# EAGLE design ma8x8_interface (EAGLE 6.6.0)
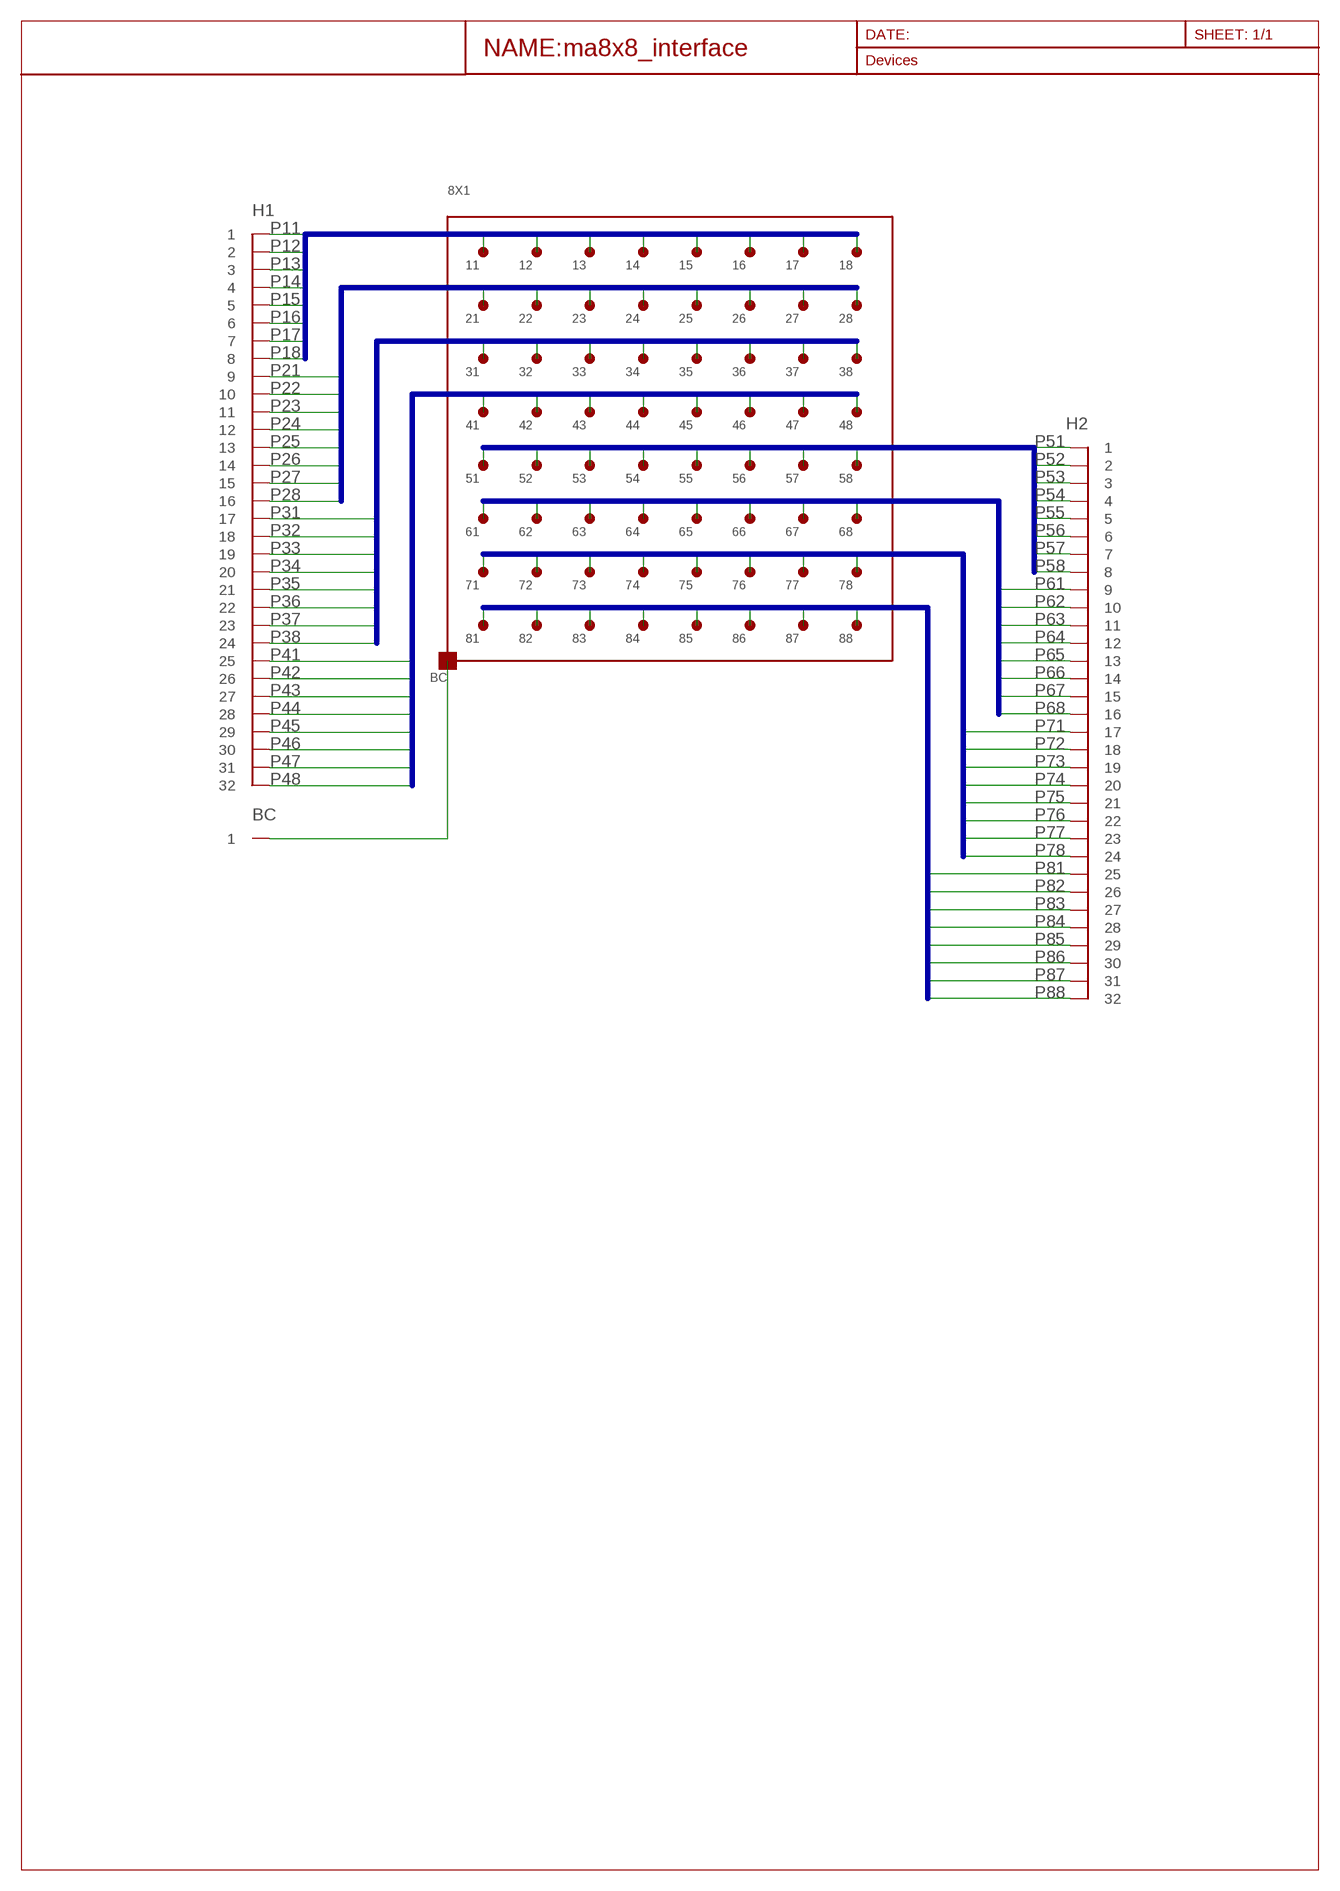
[diagram p0: schematic, sheet 1]

## Parts
8X1  8X8-POGO  [8X8-POGO]
BC  D01-9920146  [D01-9920146]
H1  D01-9923246  [D01-9923246]
H2  D01-9923246  [D01-9923246]

## Nets
BC: 8X1.B1(B) 8X1.B2(B) 8X1.B3(B) 8X1.B4(B) 8X1.B5(B) 8X1.B6(B) 8X1.B7(B) 8X1.B8(B) BC.1
P11: 8X1.11 H1.1
P12: 8X1.12 H1.2
P13: 8X1.13 H1.3
P14: 8X1.14 H1.4
P15: 8X1.15 H1.5
P16: 8X1.16 H1.6
P17: 8X1.17 H1.7
P18: 8X1.18 H1.8
P21: 8X1.21 H1.9
P22: 8X1.22 H1.10
P23: 8X1.23 H1.11
P24: 8X1.24 H1.12
P25: 8X1.25 H1.13
P26: 8X1.26 H1.14
P27: 8X1.27 H1.15
P28: 8X1.28 H1.16
P31: 8X1.31 H1.17
P32: 8X1.32 H1.18
P33: 8X1.33 H1.19
P34: 8X1.34 H1.20
P35: 8X1.35 H1.21
P36: 8X1.36 H1.22
P37: 8X1.37 H1.23
P38: 8X1.38 H1.24
P41: 8X1.41 H1.25
P42: 8X1.42 H1.26
P43: 8X1.43 H1.27
P44: 8X1.44 H1.28
P45: 8X1.45 H1.29
P46: 8X1.46 H1.30
P47: 8X1.47 H1.31
P48: 8X1.48 H1.32
P51: 8X1.51 H2.1
P52: 8X1.52 H2.2
P53: 8X1.53 H2.3
P54: 8X1.54 H2.4
P55: 8X1.55 H2.5
P56: 8X1.56 H2.6
P57: 8X1.57 H2.7
P58: 8X1.58 H2.8
P61: 8X1.61 H2.9
P62: 8X1.62 H2.10
P63: 8X1.63 H2.11
P64: 8X1.64 H2.12
P65: 8X1.65 H2.13
P66: 8X1.66 H2.14
P67: 8X1.67 H2.15
P68: 8X1.68 H2.16
P71: 8X1.71 H2.17
P72: 8X1.72 H2.18
P73: 8X1.73 H2.19
P74: 8X1.74 H2.20
P75: 8X1.75 H2.21
P76: 8X1.76 H2.22
P77: 8X1.77 H2.23
P78: 8X1.78 H2.24
P81: 8X1.81 H2.25
P82: 8X1.82 H2.26
P83: 8X1.83 H2.27
P84: 8X1.84 H2.28
P85: 8X1.85 H2.29
P86: 8X1.86 H2.30
P87: 8X1.87 H2.31
P88: 8X1.88 H2.32

## Buses
P[11..18]
P[21..28]
P[31..38]
P[41..48]
P[51..58]
P[61..68]
P[71..78]
P[81..88]

## Library data of the parts
8X1 = pv-measurement-array:8X8-POGO
BC = con-headers-harvin:D01-9920146
H1 H2 = con-headers-harvin:D01-9923246

## Board
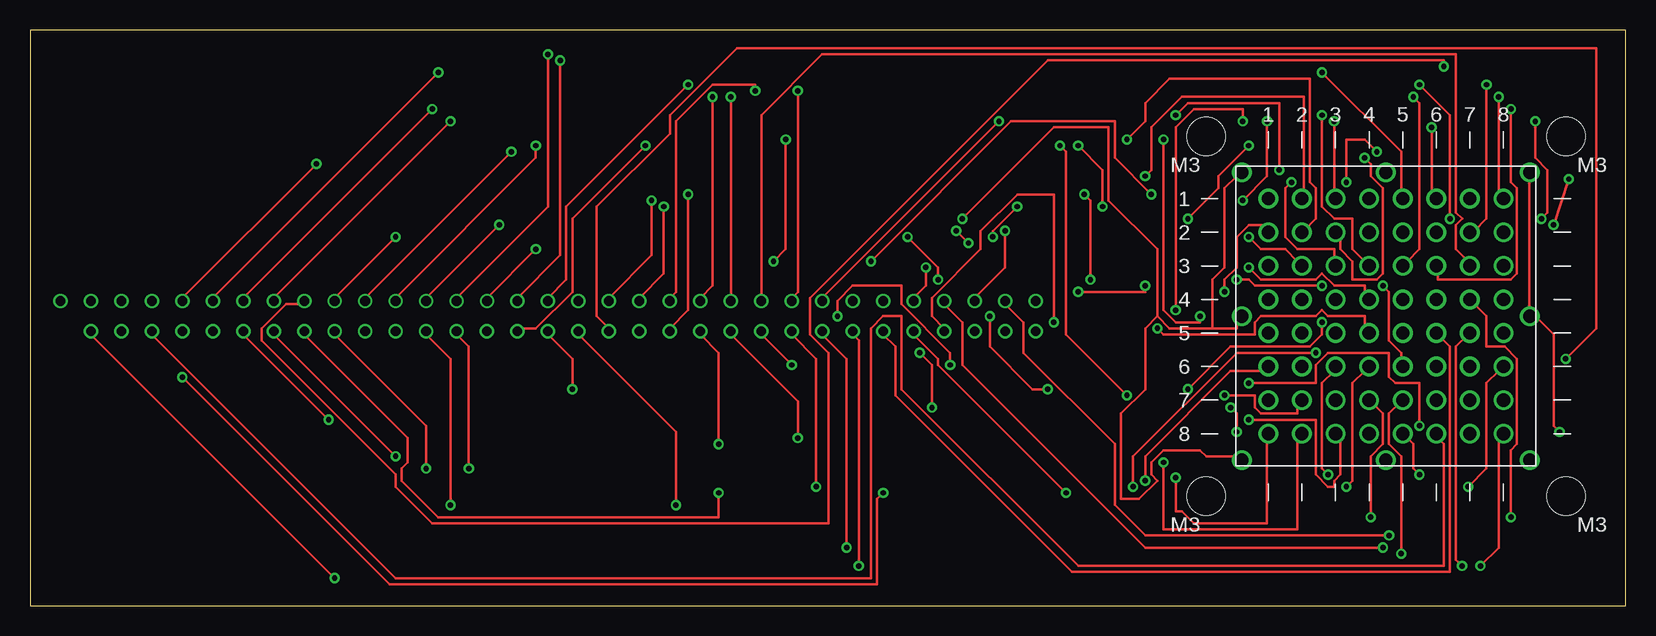
[diagram p1: board, top side]
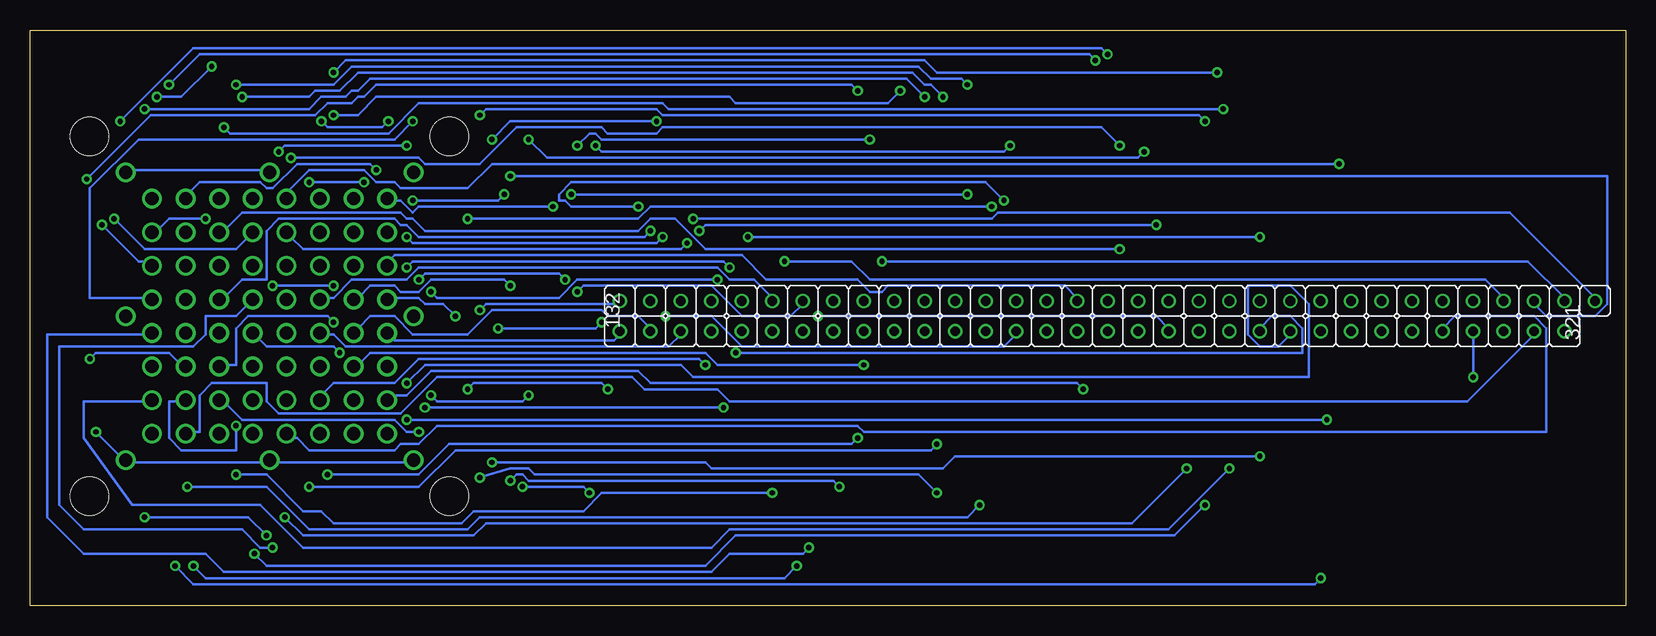
[diagram p2: board, bottom side, seen from below]

Size 133 x 48 mm. Coordinates in mm from the lower left corner, seen from the top.
Outline: 0,0 133,0 133,48 0,48 0,0
Copper layers (1*16): Top 0.035mm / dielectric 1.5mm / Bottom 0.035mm
Design rules "aisler_2_layer_simple": minimum track width 0.2mm, minimum drill 0.45mm, track to track 0.175mm, track to pad 0.175mm, pad to pad 0.175mm, via to via 0.175mm, smd to smd 0.175mm, copper to edge 0.3mm, drill to drill 0.25mm, minimum pad ring 0.2mm, minimum via ring 0.2mm, stop-mask expansion 0mil, vias tented up to drill 0mil, thermal gap 10mil
tRestrict: area 96,37.1 to 100.1,41.1; area 126,37.1 to 130,41.1; area 126,7.1 to 130,11.2; area 96,7.1 to 100.1,11.2
bRestrict: area 96,37.1 to 100.1,41.1; area 126,37.1 to 130,41.1; area 126,7.1 to 130,11.2; area 96,7.1 to 100.1,11.2

### Footprints (pad centres in the part's own frame; a part is rotated, then mirrored left to right if it is on the bottom)
8X8-POGO = drill 1.1: 11 -9.8,9.8; 12 -7,9.8; 13 -4.2,9.8; 14 -1.4,9.8; 15 1.4,9.8; 16 4.2,9.8; 17 7,9.8; 18 9.8,9.8; 21 -9.8,7; 22 -7,7; 23 -4.2,7; 24 -1.4,7; 25 1.4,7; 26 4.2,7; 27 7,7; 28 9.8,7; 31 -9.8,4.2; 32 -7,4.2; 33 -4.2,4.2; 34 -1.4,4.2; 35 1.4,4.2; 36 4.2,4.2; 37 7,4.2; 38 9.8,4.2; 41 -9.8,1.4; 42 -7,1.4; 43 -4.2,1.4; 44 -1.4,1.4; 45 1.4,1.4; 46 4.2,1.4; 47 7,1.4; 48 9.8,1.4; 51 -9.8,-1.4; 52 -7,-1.4; 53 -4.2,-1.4; 54 -1.4,-1.4; 55 1.4,-1.4; 56 4.2,-1.4; 57 7,-1.4; 58 9.8,-1.4; 61 -9.8,-4.2; 62 -7,-4.2; 63 -4.2,-4.2; 64 -1.4,-4.2; 65 1.4,-4.2; 66 4.2,-4.2; 67 7,-4.2; 68 9.8,-4.2; 71 -9.8,-7; 72 -7,-7; 73 -4.2,-7; 74 -1.4,-7; 75 1.4,-7; 76 4.2,-7; 77 7,-7; 78 9.8,-7; 81 -9.8,-9.8; 82 -7,-9.8; 83 -4.2,-9.8; 84 -1.4,-9.8; 85 1.4,-9.8; 86 4.2,-9.8; 87 7,-9.8; 88 9.8,-9.8; B1 -12,12; B2 0,12; B3 12,12; B4 12,0; B5 12,-12; B6 0,-12; B7 -12,-12; B8 -12,0 | hole 3.2: -15,15; 15,15; 15,-15; -15,-15
D01-9920146 = drill 0.8: 1 0,0
D01-9923246 = drill 0.8: 1 0,0; 2 0,2.54; 3 0,5.08; 4 0,7.62; 5 0,10.16; 6 0,12.7; 7 0,15.24; 8 0,17.78; 9 0,20.32; 10 0,22.86; 11 0,25.4; 12 0,27.94; 13 0,30.48; 14 0,33.02; 15 0,35.56; 16 0,38.1; 17 0,40.64; 18 0,43.18; 19 0,45.72; 20 0,48.26; 21 0,50.8; 22 0,53.34; 23 0,55.88; 24 0,58.42; 25 0,60.96; 26 0,63.5; 27 0,66.04; 28 0,68.58; 29 0,71.12; 30 0,73.66; 31 0,76.2; 32 0,78.74

### Placement (x,y rotation side)
8X1  113.03,24.13 0 top
BC  2.54,25.4 0 bottom
H1  5.08,25.4 90 bottom
H2  83.82,22.86 270 bottom

### Tracks (layer width: path | path; a pad name or v marks a point on that pad's centre or on a via)
BC  (via drill 0.45)
  Top 0.2: 8X1.B3 124.97,35.81 124.97,24.13 8X1.B4 125.48,24.13 127,22.61 127,14.99 v127.51,14.48 | v77.72,32.26 85.34,39.88 89.92,39.88 89.92,33.78 93.98,29.72 93.98,24.13 | 93.98,24.13 95,23.11 98.55,23.11 | 98.55,23.11 100.58,23.11 100.58,24.13 8X1.B8 | 98.55,23.11 98.55,27.18 99.57,28.19 99.57,34.8 100.58,35.81 8X1.B1 | 93.98,24.13 92.96,23.11 92.96,18.03 90.93,16 90.93,8.89 92.46,8.89 93.98,10.41 93.47,10.92 93.47,11.94 94.49,12.95 97.54,12.95 98.04,12.45 100.58,12.45 8X1.B7
  Bottom 0.2: 8X1.B7 101.09,11.94 112.78,11.94 8X1.B6 113.28,11.94 124.97,11.94 8X1.B5 125.48,12.45 v127.51,14.48 | 8X1.B2 113.28,36.32 124.97,36.32 8X1.B3 | v77.72,32.26 52.83,32.26 52.32,32.77 9.65,32.77 2.54,25.65 BC.1
P11  (via drill 0.45)
  Top 0.2: v61.98,28.7 62.99,29.72 v62.99,38.86 | v87.38,38.35 89.41,36.32 v89.41,33.27
  Bottom 0.2: v61.98,28.7 8.13,28.7 5.08,25.65 H1.1 | v62.99,38.86 85.34,38.86 85.85,39.37 86.36,39.37 v87.38,38.35 | v89.41,33.27 100.58,33.27 101.09,32.77 102.11,33.78 103.12,33.78 8X1.11
P12  (via drill 0.45)
  Top 0.2: v92.96,35.81 93.47,36.32 93.47,39.88 96.01,42.42 106.17,42.42 106.17,34.29 8X1.12
  Bottom 0.2: v92.96,35.81 1.52,35.81 1.52,25.15 2.54,24.13 6.6,24.13 7.62,25.15 H1.2
P13  (via drill 0.45)
  Top 0.2: v70.1,28.7 81.79,40.39 90.42,40.39 90.42,37.34 v93.47,34.29 | v101.09,33.78 103.12,35.81 v103.12,40.39 | v108.71,40.39 108.71,34.29 8X1.13
  Bottom 0.2: v70.1,28.7 64.52,28.7 62.99,27.18 11.68,27.18 10.16,25.65 H1.3 | v93.47,34.29 93.98,33.78 v101.09,33.78 | v103.12,40.39 103.63,39.88 108.2,39.88 v108.71,40.39
P14  (via drill 0.45)
  Top 0.2: v23.88,36.83 12.7,25.65 H1.4
  Bottom 0.2: v23.88,36.83 94.49,36.83 96.52,34.8 102.11,34.8 102.62,35.31 104.14,35.31 105.16,36.32 109.73,36.32 111.76,34.29 8X1.14
P15  (via drill 0.45)
  Top 0.2: v34.04,44.45 15.24,25.65 H1.5 | v107.7,44.45 114.3,37.85 114.3,34.29 8X1.15
  Bottom 0.2: v34.04,44.45 57.4,44.45 58.42,45.47 106.68,45.47 v107.7,44.45
P16  (via drill 0.45)
  Top 0.2: v33.53,41.4 17.78,25.65 H1.6 | v116.84,39.88 116.84,34.29 8X1.16
  Bottom 0.2: v33.53,41.4 79.76,41.4 80.26,41.91 100.58,41.91 103.12,39.37 116.33,39.37 v116.84,39.88
P17  (via drill 0.45)
  Top 0.2: v35.05,40.39 20.32,25.65 H1.7 | v95.5,40.89 96.52,41.91 104.14,41.91 v104.14,36.32
  Bottom 0.2: v35.05,40.39 35.56,40.89 80.26,40.89 80.77,41.4 95,41.4 v95.5,40.89 | v104.14,36.32 104.65,36.83 110.74,36.83 112.78,34.8 113.28,34.8 113.79,35.31 118.87,35.31 119.89,34.29 8X1.17
P18  (via drill 0.45)
  Top 0.2: v117.86,44.96 117.86,45.47 84.84,45.47 65.02,25.65 65.02,22.61 66.55,21.08 66.55,6.86 33.53,6.86 30.48,9.91 30.48,10.92 19.3,22.1 19.3,23.11 21.34,25.15 22.86,25.15 H1.8 | v122.43,42.42 122.43,34.29 8X1.18
  Bottom 0.2: v117.86,44.96 120.4,42.42 v122.43,42.42
P21  (via drill 0.45)
  Top 0.2: v30.48,30.73 25.4,25.65 H1.9 | v73.15,30.73 75.69,28.19 v75.69,27.18 | v99.57,26.16 99.57,27.18 100.58,28.19 100.58,30.73 101.6,31.75 103.12,31.75 103.12,31.24 8X1.21
  Bottom 0.2: v73.15,30.73 v30.48,30.73 | v75.69,27.18 87.38,27.18 88.9,25.65 99.06,25.65 v99.57,26.16
P22  (via drill 0.45)
  Top 0.2: v40.13,37.85 27.94,25.65 H1.10 | v91.44,38.86 92.96,40.39 92.96,41.91 95,43.94 106.68,43.94 106.68,35.31 107.19,34.8 107.19,32.26 106.17,31.24 8X1.22
  Bottom 0.2: v40.13,37.85 40.64,37.34 89.92,37.34 v91.44,38.86
P23  (via drill 0.45)
  Top 0.2: v42.16,38.35 42.16,37.34 30.48,25.65 H1.11 | v111.25,37.34 111.76,36.83 111.76,35.81 112.78,34.8 112.78,27.69 112.27,27.18 110.24,27.18 110.24,28.7 109.22,29.72 109.22,30.73 8X1.23
  Bottom 0.2: v42.16,38.35 43.69,39.88 80.26,39.88 80.77,39.37 84.84,39.37 85.34,39.88 92.46,39.88 95.5,36.83 100.08,36.83 100.58,37.34 v111.25,37.34
P24  (via drill 0.45)
  Top 0.2: v39.12,31.75 33.02,25.65 H1.12 | v78.23,30.23 v77.22,31.24
  Bottom 0.2: v39.12,31.75 76.71,31.75 v77.22,31.24 | v78.23,30.23 78.74,29.72 110.24,29.72 111.25,30.73 8X1.24
P25  (via drill 0.45)
  Top 0.2: v43.18,45.97 43.18,33.27 35.56,25.65 H1.13 | v125.48,40.39 125.48,37.34 126.49,36.32 126.49,32.77 v125.98,32.26
  Bottom 0.2: v43.18,45.97 43.69,46.48 119.38,46.48 v125.48,40.39 | v125.98,32.26 123.44,29.72 115.82,29.72 114.81,30.73 8X1.25
P26  (via drill 0.45)
  Top 0.2: v42.16,29.72 38.1,25.65 H1.14
  Bottom 0.2: v42.16,29.72 76.71,29.72 79.25,32.26 81.28,32.26 82.3,31.24 100.08,31.24 101.09,32.26 101.6,32.26 102.11,32.77 115.32,32.77 116.84,31.24 8X1.26
P27  (via drill 0.45)
  Top 0.2: v44.2,45.47 44.2,29.21 40.64,25.65 H1.15 | v121.41,43.43 121.41,32.26 120.4,31.24 8X1.27
  Bottom 0.2: v44.2,45.47 44.7,45.97 118.87,45.97 v121.41,43.43
P28  (via drill 0.45)
  Top 0.2: v54.86,43.43 44.7,33.27 44.7,27.18 43.18,25.65 H1.16 | v115.82,43.43 118.36,40.89 v118.36,32.26
  Bottom 0.2: v54.86,43.43 55.37,43.94 57.91,43.94 58.93,44.96 106.17,44.96 107.7,43.43 v115.82,43.43 | v118.36,32.26 121.41,32.26 122.43,31.24 8X1.28
P31
  Bottom 0.2: H1.17 45.72,25.65 46.74,26.67 61.47,26.67 61.98,26.16 62.99,26.16 64.01,27.18 71.63,27.18 73.66,29.21 102.62,29.21 103.12,28.7 8X1.31
P32  (via drill 0.45)
  Top 0.2: v51.82,33.78 51.82,29.21 48.26,25.65 H1.18 | v82.3,33.27 80.26,31.24 v80.26,30.73 | v101.6,30.73 102.62,29.72 104.65,29.72 105.66,28.7 8X1.32
  Bottom 0.2: v51.82,33.78 53.34,35.31 87.88,35.31 88.9,34.29 88.9,33.78 88.39,33.78 87.88,33.27 v82.3,33.27 | v80.26,30.73 80.77,30.23 101.09,30.23 v101.6,30.73
P33  (via drill 0.45)
  Top 0.2: v52.83,33.27 52.83,27.69 50.8,25.65 H1.19 | v96.52,32.26 99.06,34.8 99.06,35.81 v101.6,38.35 | v112.27,37.85 111.25,38.86 109.73,38.86 v109.73,35.31 | v105.16,35.31 104.65,34.8 104.65,30.73 105.66,29.72 108.71,29.72 108.71,28.7 8X1.33
  Bottom 0.2: v52.83,33.27 81.28,33.27 82.3,32.26 v96.52,32.26 | v101.6,38.35 111.76,38.35 v112.27,37.85 | v105.16,35.31 v109.73,35.31
P34  (via drill 0.45)
  Top 0.2: v60.45,42.93 60.45,43.43 56.9,43.43 53.85,40.39 53.85,26.16 53.34,25.65 H1.20 | v107.7,40.89 107.7,33.27 108.71,32.26 110.24,32.26 110.24,29.72 111.25,28.7 8X1.34
  Bottom 0.2: v60.45,42.93 61.47,41.91 74.17,41.91 74.68,42.42 104.14,42.42 105.66,40.89 v107.7,40.89
P35  (via drill 0.45)
  Top 0.2: v56.9,42.42 56.9,26.67 55.88,25.65 H1.21 | v115.32,42.42 115.82,41.91 115.82,29.72 114.81,28.7 8X1.35
  Bottom 0.2: v56.9,42.42 57.91,43.43 58.42,43.43 59.44,44.45 105.66,44.45 107.19,42.93 109.22,42.93 109.73,42.42 v115.32,42.42
P36  (via drill 0.45)
  Top 0.2: v58.42,42.42 H1.22 | v123.44,41.4 123.44,35.31 123.95,34.8 123.95,27.69 123.44,27.18 117.35,27.18 117.35,28.19 8X1.36
  Bottom 0.2: v58.42,42.42 59.94,43.94 104.65,43.94 105.66,42.93 106.17,42.93 106.68,42.42 108.71,42.42 109.73,41.4 v123.44,41.4
P37
  Top 0.2: H1.23 60.96,40.89 66.04,45.97 118.87,45.97 118.87,32.77 119.38,32.26 118.87,31.75 118.87,29.72 119.89,28.7 8X1.37
P38  (via drill 0.45)
  Top 0.2: v64.01,42.93 64.01,26.16 63.5,25.65 H1.24 | v127,31.75 v128.27,35.56
  Bottom 0.2: v64.01,42.93 64.52,43.43 104.14,43.43 105.16,42.42 105.66,42.42 106.17,41.91 108.2,41.91 109.22,40.89 122.94,40.89 v128.27,35.56 | v127,31.75 123.95,28.7 122.94,28.7 8X1.38
P41  (via drill 0.45)
  Top 0.2: v80.77,40.39 66.04,25.65 H1.25 | v94.49,38.86 94.49,24.64 95.5,23.62 97.54,23.62 v97.54,24.13
  Bottom 0.2: v80.77,40.39 92.96,40.39 v94.49,38.86 | v97.54,24.13 98.55,25.15 100.08,25.15 100.58,25.65 103.12,25.65 8X1.41
P42  (via drill 0.45)
  Top 0.2: v87.38,26.16 92.96,26.16 v92.96,26.67
  Bottom 0.2: v87.38,26.16 86.87,26.67 76.2,26.67 73.66,24.13 69.6,24.13 68.58,25.15 H1.26 | v92.96,26.67 93.47,27.18 99.57,27.18 100.58,26.16 102.11,26.16 102.62,26.67 104.65,26.67 105.66,25.65 8X1.42
P43
  Bottom 0.2: H1.27 71.12,25.65 72.64,27.18 74.68,27.18 75.69,28.19 100.58,28.19 101.6,27.18 106.17,27.18 107.7,25.65 108.71,25.65 8X1.43
P44  (via drill 0.45)
  Top 0.2: v74.68,28.19 74.68,26.67 73.66,25.65 H1.28 | v101.6,28.19 102.62,27.18 107.19,27.18 107.7,27.69 108.71,26.67 111.25,26.67 111.25,25.65 8X1.44
  Bottom 0.2: v74.68,28.19 75.18,28.7 101.09,28.7 v101.6,28.19
P45  (via drill 0.45)
  Top 0.2: v112.78,4.83 92.96,4.83 77.72,20.07 77.72,23.62 76.2,25.15 H1.29
  Bottom 0.2: v112.78,4.83 113.79,4.83 115.32,6.35 128.52,6.35 130.56,8.38 130.56,21.59 119.38,21.59 118.36,22.61 118.36,24.13 115.82,24.13 114.81,25.15 8X1.45
P46  (via drill 0.45)
  Top 0.2: v81.28,31.24 81.28,28.19 78.74,25.65 H1.30
  Bottom 0.2: v81.28,31.24 81.79,30.73 100.58,30.73 101.6,31.75 102.11,31.75 102.62,32.26 112.27,32.26 113.28,31.24 113.28,27.18 115.32,27.18 116.84,25.65 8X1.46
P47  (via drill 0.45)
  Top 0.2: v113.28,5.84 92.96,5.84 90.42,8.38 90.42,13.46 82.8,21.08 82.8,23.62 81.28,25.15 H1.31 | v123.44,7.37 123.44,12.95 123.95,13.46 123.95,20.57 122.94,21.59 121.41,21.59 121.41,24.13 120.4,25.15 8X1.47
  Bottom 0.2: v113.28,5.84 114.81,7.37 v123.44,7.37
P48  (via drill 0.45)
  Top 0.2: v95.5,24.64 95.5,39.88 97.03,41.4 101.09,41.4 v101.09,40.39
  Bottom 0.2: v95.5,24.64 95,25.15 83.82,25.15 H1.32 | v101.09,40.39 102.62,38.86 123.95,38.86 128.02,34.8 128.02,25.65 122.94,25.65 8X1.48
P51
  Bottom 0.2: H2.1 83.82,22.61 84.33,22.1 102.62,22.1 103.12,22.61 8X1.51
P52
  Bottom 0.2: H2.2 81.28,23.11 82.3,24.13 84.84,24.13 85.34,24.64 94.49,24.64 96.52,22.61 101.09,22.61 102.62,24.13 104.65,24.13 105.66,23.11 8X1.52
P53
  Bottom 0.2: H2.3 78.74,22.61 79.76,21.59 106.68,21.59 107.7,22.61 108.71,22.61 8X1.53
P54  (via drill 0.45)
  Top 0.2: v85.34,23.62 85.34,34.29 82.3,34.29 79.25,31.24 79.25,29.72 75.18,25.65 75.18,24.13 76.2,23.11 H2.4 | v93.98,23.11 94.49,22.61 102.11,22.61 102.11,23.62 102.62,24.13 107.19,24.13 107.7,24.64 108.2,24.13 111.25,24.13 111.25,23.11 8X1.54
  Bottom 0.2: v85.34,23.62 85.85,23.11 v93.98,23.11
P55  (via drill 0.45)
  Top 0.2: v86.36,9.4 75.69,20.07 75.69,20.57 73.66,22.61 H2.5 | v91.95,9.91 91.95,12.45 100.58,21.08 v107.19,21.08
  Bottom 0.2: v86.36,9.4 86.87,9.91 v91.95,9.91 | v107.19,21.08 107.7,21.59 113.28,21.59 114.3,22.61 8X1.55
P56
  Top 0.2: H2.6 71.12,22.61 72.14,21.59 72.14,17.53 86.87,2.79 118.36,2.79 118.36,21.59 117.35,22.61 8X1.56
P57  (via drill 0.45)
  Top 0.2: v69.09,3.3 69.09,22.1 68.58,22.61 H2.7 | v119.38,3.3 118.87,3.81 118.87,21.59 119.89,22.61 8X1.57
  Bottom 0.2: v69.09,3.3 70.1,2.29 118.36,2.29 v119.38,3.3
P58  (via drill 0.45)
  Top 0.2: v68.07,4.83 68.07,20.57 66.04,22.61 H2.8
  Bottom 0.2: v68.07,4.83 68.58,4.32 74.68,4.32 76.2,2.79 116.84,2.79 118.36,4.32 128.52,4.32 131.57,7.37 131.57,22.61 122.94,22.61 8X1.58
P61  (via drill 0.45)
  Top 0.2: v65.53,9.91 65.53,20.57 63.5,22.61 H2.9 | v92.96,10.41 92.96,12.45 100.08,19.56 103.12,19.56 8X1.61
  Bottom 0.2: v65.53,9.91 66.04,10.41 91.44,10.41 91.95,10.92 92.46,10.92 v92.96,10.41
P62  (via drill 0.45)
  Top 0.2: v63.5,20.07 60.96,22.61 H2.10
  Bottom 0.2: v63.5,20.07 75.69,20.07 76.71,21.08 104.65,21.08 105.66,20.07 8X1.62
P63  (via drill 0.45)
  Top 0.2: v64.01,13.97 64.01,17.02 58.42,22.61 H2.11 | v108.2,10.92 107.7,11.43 107.7,18.54 108.71,19.56 8X1.63
  Bottom 0.2: v64.01,13.97 64.52,13.46 98.04,13.46 100.58,10.92 v108.2,10.92
P64  (via drill 0.45)
  Top 0.2: v57.4,13.46 57.4,21.08 55.88,22.61 H2.12 | v109.73,9.91 110.24,10.41 110.24,18.54 111.25,19.56 8X1.64
  Bottom 0.2: v57.4,13.46 57.91,12.95 97.54,12.95 100.58,9.91 v109.73,9.91
P65  (via drill 0.45)
  Top 0.2: v54.86,34.29 54.86,24.64 53.34,23.11 H2.13 | v87.88,34.29 88.39,33.78 v88.39,27.18 | v100.58,27.18 101.6,27.18 102.11,26.67 v107.7,26.67 | v112.78,26.67 113.28,26.16 113.28,22.1 114.3,21.08 114.3,20.07 8X1.65
  Bottom 0.2: v87.88,34.29 v54.86,34.29 | v88.39,27.18 88.9,27.69 100.08,27.69 v100.58,27.18 | v112.78,26.67 v107.7,26.67
P66  (via drill 0.45)
  Top 0.2: v96.52,18.03 100.08,21.59 106.68,21.59 107.7,22.61 v107.7,23.62 | v84.84,18.03 83.57,18.03 80.01,21.59 v80.01,24.13
  Bottom 0.2: v84.84,18.03 85.34,18.54 96.01,18.54 v96.52,18.03 | v107.7,23.62 108.2,24.13 114.81,24.13 115.82,23.11 115.82,20.07 116.84,20.07 8X1.66 | H2.14 50.8,22.61 51.82,21.59 73.66,21.59 76.2,24.13 v80.01,24.13
P67  (via drill 0.45)
  Top 0.2: v128.02,20.57 130.56,23.11 130.56,46.48 58.93,46.48 53.34,40.89 53.34,39.37 47.24,33.27 47.24,24.13 48.26,23.11 H2.15
  Bottom 0.2: v128.02,20.57 127.51,21.08 121.41,21.08 120.4,20.07 8X1.67
P68  (via drill 0.45)
  Top 0.2: v53.85,8.38 53.85,14.48 45.72,22.61 H2.16 | v119.89,9.91 121.41,11.43 121.41,18.54 122.43,19.56 8X1.68
  Bottom 0.2: v53.85,8.38 54.86,7.37 95.5,7.37 96.52,6.35 109.73,6.35 113.28,9.91 v119.89,9.91
P71  (via drill 0.45)
  Top 0.2: v45.21,18.03 45.21,20.57 43.18,22.61 H2.17
  Bottom 0.2: v45.21,18.03 45.72,18.54 81.28,18.54 82.3,19.56 99.57,19.56 101.6,17.53 103.12,17.53 8X1.71
P72  (via drill 0.45)
  Top 0.2: v51.31,38.35 45.21,32.26 45.21,26.16 42.16,23.11 40.64,23.11 H2.18 | v85.85,38.35 86.36,37.85 86.36,22.61 v91.44,17.53 | v99.57,17.53 102.11,17.53 102.11,16.51 102.62,16 105.66,16 105.66,17.02 8X1.72
  Bottom 0.2: v51.31,38.35 51.82,37.85 85.34,37.85 v85.85,38.35 | v91.44,17.53 91.95,17.02 99.06,17.02 v99.57,17.53
P73  (via drill 0.45)
  Top 0.2: v76.71,20.07 76.71,21.08 72.64,25.15 72.64,26.67 71.12,26.67 68.58,26.67 67.31,25.4 v67.31,24.13
  Bottom 0.2: v76.71,20.07 77.22,20.57 100.58,20.57 102.62,18.54 107.7,18.54 108.71,17.53 8X1.73 | H2.19 38.1,23.11 39.12,24.13 v67.31,24.13
P74  (via drill 0.45)
  Top 0.2: v36.58,11.43 36.58,21.59 35.56,22.61 H2.20 | v111.76,7.37 111.76,12.45 112.78,13.46 112.78,16 111.76,17.02 8X1.74
  Bottom 0.2: v36.58,11.43 41.15,6.86 95,6.86 96.01,5.84 110.24,5.84 v111.76,7.37
P75  (via drill 0.45)
  Top 0.2: v35.05,8.38 35.05,20.57 33.02,22.61 H2.21 | v114.3,4.32 114.3,12.45 113.28,13.46 113.28,16 114.3,17.02 8X1.75
  Bottom 0.2: v35.05,8.38 37.59,5.84 74.17,5.84 76.71,3.3 113.28,3.3 v114.3,4.32
P76  (via drill 0.45)
  Top 0.2: v74.17,21.08 75.18,20.07 v75.18,16.51 | v100.08,16.51 100.58,16 v100.58,14.48
  Bottom 0.2: v74.17,21.08 26.92,21.08 26.92,23.11 27.94,24.13 29.46,24.13 30.48,23.11 H2.22 | v100.08,16.51 v75.18,16.51 | v100.58,14.48 101.6,14.48 102.62,15.49 115.32,15.49 116.84,17.02 8X1.76
P77  (via drill 0.45)
  Top 0.2: v101.6,18.54 107.19,18.54 107.19,20.07 108.2,21.08 113.28,21.08 113.28,19.05 113.79,18.54 115.82,18.54 v115.82,14.99
  Bottom 0.2: v101.6,18.54 100.08,20.07 78.74,20.07 77.72,19.05 26.42,19.05 26.42,25.15 27.94,26.67 31.5,26.67 31.5,22.61 30.48,21.59 28.96,21.59 27.94,22.61 H2.23 | v115.82,14.99 115.82,12.95 120.4,12.95 121.41,13.97 121.41,17.02 120.4,17.02 8X1.77
P78  (via drill 0.45)
  Top 0.2: v33.02,11.43 33.02,14.99 25.4,22.61 H2.24
  Bottom 0.2: v33.02,11.43 38.1,6.35 74.68,6.35 76.2,4.83 110.24,4.83 113.79,8.38 124.46,8.38 128.52,13.97 128.52,17.02 122.94,17.02 8X1.78
P81  (via drill 0.45)
  Top 0.2: v57.4,9.4 57.4,7.37 34.04,7.37 30.99,10.41 30.99,11.43 31.5,11.94 31.5,13.97 22.86,22.61 H2.25 | 8X1.81 103.12,13.97 103.12,6.86 97.03,6.86 96.01,7.87 95.5,7.87 v95.5,10.67
  Bottom 0.2: v57.4,9.4 58.93,10.92 90.93,10.92 91.44,11.43 92.96,11.43 v95.5,10.67
P82  (via drill 0.45)
  Top 0.2: v30.48,12.45 20.32,22.61 H2.26 | v94.49,11.94 94.49,6.35 105.66,6.35 105.66,13.97 8X1.82
  Bottom 0.2: v30.48,12.45 55.88,12.45 56.9,11.43 76.2,11.43 76.71,11.94 v94.49,11.94
P83  (via drill 0.45)
  Top 0.2: v24.89,15.49 17.78,22.61 H2.27 | v101.6,15.49 107.19,15.49 107.19,10.92 108.2,9.91 108.71,9.91 108.71,10.41 109.22,10.92 109.22,13.97 8X1.83
  Bottom 0.2: v101.6,15.49 v24.89,15.49
P84
  Bottom 0.2: H2.28 15.24,23.11 14.22,24.13 7.62,24.13 6.6,23.11 6.6,14.48 63.5,14.48 64.01,14.99 99.06,14.99 100.58,13.46 102.11,13.46 102.62,12.95 109.73,12.95 110.74,13.97 111.25,13.97 8X1.84
P85  (via drill 0.45)
  Top 0.2: v12.7,19.05 29.97,1.78 70.61,1.78 70.61,8.89 v71.12,9.4 | v115.82,10.92 115.32,11.43 115.32,13.46 114.81,13.97 8X1.85
  Bottom 0.2: v12.7,19.05 H2.29 | v71.12,9.4 85.34,9.4 86.87,7.87 96.01,7.87 97.03,6.86 107.7,6.86 108.71,7.87 110.24,7.87 113.28,10.92 v115.82,10.92
P86
  Top 0.2: H2.30 10.16,22.61 30.48,2.29 70.1,2.29 70.1,23.11 71.12,24.13 72.64,24.13 72.64,18.03 87.38,3.3 117.86,3.3 117.86,13.46 117.35,13.97 8X1.86
P87
  Bottom 0.2: H2.31 7.62,22.61 13.21,17.02 74.68,17.02 75.69,18.03 81.79,18.03 82.8,19.05 99.06,19.05 102.11,16 112.27,16 113.28,17.02 113.28,18.54 117.86,18.54 118.87,17.53 118.87,14.48 119.89,14.48 8X1.87
P88  (via drill 0.45)
  Top 0.2: v25.4,2.29 5.08,22.61 H2.32 | v120.9,3.3 122.43,4.83 122.43,13.97 8X1.88
  Bottom 0.2: v25.4,2.29 25.91,1.78 119.38,1.78 v120.9,3.3